# Altium schematic sheet modFOC-MCU.SchDoc: modFOC-MCU
size A4; Author: Thomas Hofmann; DocumentNumber: 2; Revision: 1.0; SheetNumber: 2; SheetTotal: 3
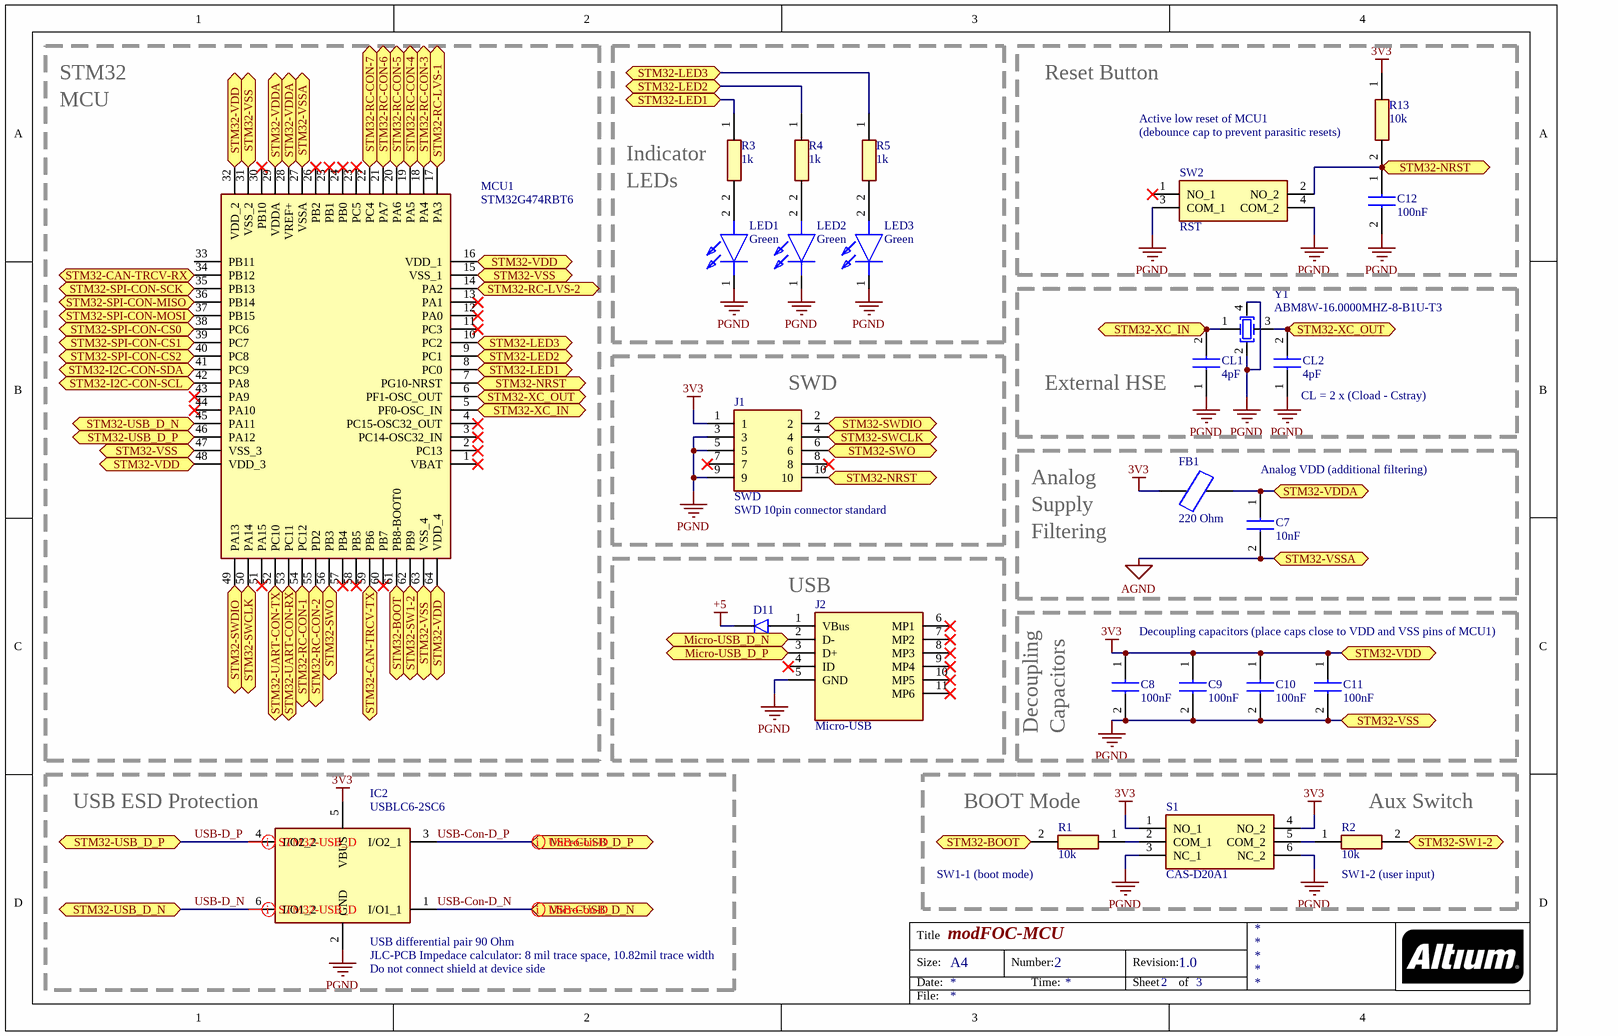
[diagram p0: modFOC-MCU.SchDoc]

## Parts
C7  10nF  [CAPC2012X88N]
C8  100nF  [CAPC1608X97N]
C9  100nF  [CAPC1608X97N]
C10  100nF  [CAPC1608X97N]
C11  100nF  [CAPC1608X97N]
C12  100nF  [CAPC1608X97N]
CL1  4pF  [CAPC1608X90N]
CL2  4pF  [CAPC1608X90N]
D11  BAS3010A03WE6327HTSA1  [SOD2513X110N]  (value not drawn)
FB1  220 Ohm  [BEADC1608X75N]
IC2  USBLC6-2SC6  [SOT95P280X145-6N]
J1  SWD  [HUSSP10W40P127_2X5_635X340X420P]
J2  Micro-USB  [19815841]
LED1  Green  [LGQ396PS35]
LED2  Green  [LGQ396PS35]
LED3  Green  [LGQ396PS35]
MCU1  STM32G474RBT6  [QFP50P1200X1200X160-64N]
R1  10k  [RESC1608X55N]
R2  10k  [RESC1608X55N]
R3  1k  [RESC1608X55N]
R4  1k  [RESC1608X55N]
R5  1k  [RESC1608X55N]
R13  10k  [RESC1608X55N]
S1  CAS-D20A1  [CASD20A1]
SW2  RST  [PTS647SK38SMTR2LFS]
Y1  ABM8W-16.0000MHZ-8-B1U-T3  [ABM8W160000MHZ8B1UT3]

## Blocks framed on the sheet
Reset Button: C12 R13 SW2
External HSE: CL1 CL2 Y1
SWD: J1
USB: D11 J2
USB ESD Protection: IC2

## Ports
Micro-USB_D_N (bidir), Micro-USB_D_P (bidir), STM32-BOOT (bidir), STM32-CAN-TRCV-RX (bidir), STM32-CAN-TRCV-TX (bidir), STM32-I2C-CON-SCL (bidir), STM32-I2C-CON-SDA (bidir), STM32-LED1 (bidir), STM32-LED2 (bidir), STM32-LED3 (bidir), STM32-NRST (bidir), STM32-RC-CON-1 (bidir), STM32-RC-CON-2 (bidir), STM32-RC-CON-3 (bidir), STM32-RC-CON-4 (bidir), STM32-RC-CON-5 (bidir), STM32-RC-CON-6 (bidir), STM32-RC-CON-7 (bidir), STM32-RC-LVS-1 (bidir), STM32-RC-LVS-2 (bidir), STM32-SPI-CON-CS0 (bidir), STM32-SPI-CON-CS1 (bidir), STM32-SPI-CON-CS2 (bidir), STM32-SPI-CON-MISO (bidir), STM32-SPI-CON-MOSI (bidir), STM32-SPI-CON-SCK (bidir), STM32-SW1-2 (bidir), STM32-SWCLK (bidir), STM32-SWDIO (bidir), STM32-SWO (bidir), STM32-UART-CON-RX (bidir), STM32-UART-CON-TX (bidir), STM32-USB_D_N (bidir), STM32-USB_D_P (bidir), STM32-VDD (bidir), STM32-VDDA (bidir), STM32-VSS (bidir), STM32-VSSA (bidir), STM32-XC_IN (bidir), STM32-XC_OUT (bidir)

## Nets
3V3: C8.1 C9.1 C10.1 C11.1 FB1.1 IC2.5(VBUS) J1.1 MCU1.16(VDD_1) MCU1.32(VDD_2) MCU1.48(VDD_3) MCU1.64(VDD_4) R13.1 S1.1(NO_1) S1.4(NO_2) ; port STM32-VDD
+5: D11.1(K)
AGND: C7.2 MCU1.27(VSSA) ; port STM32-VSSA
PGND: C8.2 C9.2 C10.2 C11.2 C12.2 CL1.1 CL2.1 IC2.2(GND) J1.3 J1.5 J1.9 J2.5(GND) LED1.1(K) LED2.1(K) LED3.1(K) MCU1.15(VSS_1) MCU1.31(VSS_2) MCU1.47(VSS_3) MCU1.63(VSS_4) S1.3(NC_1) S1.6(NC_2) SW2.3(COM_1) SW2.4(COM_2) Y1.2(OSC2) Y1.4 ; port STM32-VSS
STM32-BOOT: MCU1.61(PB8-BOOT0) R1.2 ; port STM32-BOOT
STM32-CAN-TRCV-RX: MCU1.34(PB12) ; port STM32-CAN-TRCV-RX
STM32-CAN-TRCV-TX: MCU1.59(PB6) ; port STM32-CAN-TRCV-TX
STM32-I2C-CON-SCL: MCU1.42(PA8) ; port STM32-I2C-CON-SCL
STM32-I2C-CON-SDA: MCU1.41(PC9) ; port STM32-I2C-CON-SDA
STM32-LED1: MCU1.8(PC0) R3.1 ; port STM32-LED1
STM32-LED2: MCU1.9(PC1) R4.1 ; port STM32-LED2
STM32-LED3: MCU1.10(PC2) R5.1 ; port STM32-LED3
STM32-NRST: C12.1 J1.10 MCU1.7(PG10-NRST) R13.2 SW2.2(NO_2) ; port STM32-NRST
STM32-RC-CON-1: MCU1.54(PC12) ; port STM32-RC-CON-1
STM32-RC-CON-2: MCU1.55(PD2) ; port STM32-RC-CON-2
STM32-RC-CON-3: MCU1.18(PA4) ; port STM32-RC-CON-3
STM32-RC-CON-4: MCU1.19(PA5) ; port STM32-RC-CON-4
STM32-RC-CON-5: MCU1.20(PA6) ; port STM32-RC-CON-5
STM32-RC-CON-6: MCU1.21(PA7) ; port STM32-RC-CON-6
STM32-RC-CON-7: MCU1.22(PC4) ; port STM32-RC-CON-7
STM32-RC-LVS-1: MCU1.17(PA3) ; port STM32-RC-LVS-1
STM32-RC-LVS-2: MCU1.14(PA2) ; port STM32-RC-LVS-2
STM32-SPI-CON-CS0: MCU1.38(PC6) ; port STM32-SPI-CON-CS0
STM32-SPI-CON-CS1: MCU1.39(PC7) ; port STM32-SPI-CON-CS1
STM32-SPI-CON-CS2: MCU1.40(PC8) ; port STM32-SPI-CON-CS2
STM32-SPI-CON-MISO: MCU1.36(PB14) ; port STM32-SPI-CON-MISO
STM32-SPI-CON-MOSI: MCU1.37(PB15) ; port STM32-SPI-CON-MOSI
STM32-SPI-CON-SCK: MCU1.35(PB13) ; port STM32-SPI-CON-SCK
STM32-SW1-2: MCU1.62(PB9) R2.2 ; port STM32-SW1-2
STM32-SWCLK: J1.4 MCU1.50(PA14) ; port STM32-SWCLK
STM32-SWDIO: J1.2 MCU1.49(PA13) ; port STM32-SWDIO
STM32-SWO: J1.6 MCU1.56(PB3) ; port STM32-SWO
STM32-UART-CON-RX: MCU1.53(PC11) ; port STM32-UART-CON-RX
STM32-UART-CON-TX: MCU1.52(PC10) ; port STM32-UART-CON-TX
STM32-VDDA: C7.1 FB1.2 MCU1.28(VREF+) MCU1.29(VDDA) ; port STM32-VDDA
STM32-XC_IN: CL1.2 MCU1.5(PF0-OSC_IN) Y1.1(OSC1) ; port STM32-XC_IN
STM32-XC_OUT: CL2.2 MCU1.6(PF1-OSC_OUT) Y1.3 ; port STM32-XC_OUT
USB-Con-D_N: IC2.1(I/O1_1) J2.2(D-) ; port Micro-USB_D_N
USB-Con-D_P: IC2.3(I/O2_1) J2.3(D+) ; port Micro-USB_D_P
USB-D_N: IC2.6(I/O1_2) MCU1.45(PA11) ; port STM32-USB_D_N
USB-D_P: IC2.4(I/O2_2) MCU1.46(PA12) ; port STM32-USB_D_P
NetD11_2: D11.2(A) J2.1(VBus)
NetLED1_2: LED1.2(A) R3.2
NetLED2_2: LED2.2(A) R4.2
NetLED3_2: LED3.2(A) R5.2
NetR1_1: R1.1 S1.2(COM_1)
NetR2_1: R2.1 S1.5(COM_2)

Not connected (* = marked no-connect by the designer): J1 7* 8*; J2 4(ID)* 6(MP1)* 7(MP2)* 8(MP3)* 9(MP4)* 10(MP5)* 11(MP6)*; MCU1 1(VBAT)* 2(PC13)* 3(PC14-OSC32_IN)* 4(PC15-OSC32_OUT)* 11(PC3)* 12(PA0)* 13(PA1)* 23(PC5)* 24(PB0)* 25(PB1)* 26(PB2)* 30(PB10)* 33(PB11) 43(PA9)* 44(PA10)* 51(PA15)* 57(PB4)* 58(PB5)* 60(PB7)*; SW2 1(NO_1)*

## Layout directives
differential pair; rule Differential Pairs Routing [Pref Gap = 10mil    Min Gap  = 8mil    Max Gap  = 10milPref Width = 15mil    Min Width  = 10.28mil    Max Width  = 15mil]: USB-Con-D_N, USB-Con-D_P, USB-D_N, USB-D_P

## Notes on the sheet
- STM32
- MCU
- (near R3) Indicator
- Active low reset of MCU1
- (near R13) (debounce cap to prevent parasitic resets)
- LEDs
- (near CL2) CL = 2 x (Cload - Cstray)
- (near J1) SWD 10pin connector standard
- Analog
- Supply
- Analog VDD (additional filtering)
- Filtering
- Decoupling capacitors (place caps close to VDD and VSS pins of MCU1)
- Decoupling
- Capacitors
- (near R1) BOOT Mode
- (near R2) Aux Switch
- (near R1) SW1-1 (boot mode)
- (near R2) SW1-2 (user input)
- (near IC2) USB differential pair 90 Ohm
- (near IC2) JLC-PCB Impedace calculator: 8 mil trace space, 10.82mil trace width
- (near IC2) Do not connect shield at device side
- Title
- Size:
- Date:
- A4
- Number:
- Time:
- Revision:
- Sheet
- of
- File:

## Library data of the parts
C7 = C0805C103J3GACTU: Capacitor; Manufacturer_Name: Kemet; Datasheet Link: https://componentsearchengine.com/Datasheets/2/C0805C103J3GACTU.pdf; Height: 0.88mm; Manufacturer_Part_Number: C0805C103J3GACTU; Arrow Part Number: C0805C103J3GACTU; Arrow Price/Stock: https://www.arrow.com/en/products/c0805c103j3gactu/kemet-corporation; Mouser Part Number: 80-C0805C103J3G; Mouser Price/Stock: https://www.mouser.co.uk/ProductDetail/KEMET/C0805C103J3GACTU?qs=K%2Fj%2Fqf%252B0fqJFcB%2FiaHub0Q%3D%3D
C8-C12 = VJ0603Y104JXJAC: Capacitor; Manufacturer_Name: Vishay; Datasheet Link: http://www.vishay.com/docs/45226/vj31xrohsautomlcc.pdf; Height: 0.97mm; Manufacturer_Part_Number: VJ0603Y104JXJAC; Mouser Part Number: 77-VJ0603Y104JXJAC; Mouser Price/Stock: https://www.mouser.com/Search/Refine.aspx?Keyword=77-VJ0603Y104JXJAC
CL1 CL2 = CL10C040CB8NNNC: Capacitor; Manufacturer_Name: Samsung Electro-Mechanics; Datasheet Link: https://datasheet.lcsc.com/szlcsc/Samsung-Electro-Mechanics-CL10C040CB8NNNC_C307494.pdf; Height: 0.9mm; Manufacturer_Part_Number: CL10C040CB8NNNC; Mouser Part Number: N/A; Mouser Price/Stock: https://www.mouser.co.uk/ProductDetail/Samsung-Electro-Mechanics/CL10C040CB8NNNC?qs=X6jEic%2FHinCXvSxHicvHqA%3D%3D; Arrow Part Number: CL10C040CB8NNNC; Arrow Price/Stock: https://www.arrow.com/en/products/cl10c040cb8nnnc/samsung-electro-mechanics
D11 = BAS3010A03WE6327HTSA1: Diode; Manufacturer_Name: Infineon; Datasheet Link: https://www.infineon.com/dgdl/Infineon-BAS3010ASERIES-DS-v01_01-en.pdf?fileId=db3a30431ddc9372011dfbc50f231c06; Height: 1.1mm; Manufacturer_Part_Number: BAS3010A03WE6327HTSA1; Arrow Part Number: BAS3010A03WE6327HTSA1; Arrow Price/Stock: https://www.arrow.com/en/products/bas3010a03we6327htsa1/infineon-technologies-ag; Mouser Part Number: 726-BAS3010A-03WE6; Mouser Price/Stock: https://www.mouser.co.uk/ProductDetail/Infineon-Technologies/BAS3010A03WE6327HTSA1?qs=K00xGehIljtEbk1%252B2pLZ%252BQ%3D%3D
FB1 = MPZ1608S221ATA00: Ferrite Bead; Manufacturer_Name: TDK; Datasheet Link: https://product.tdk.com/info/en/catalog/datasheets/beads_commercial_power_mpz1608_en.pdf; Height: 0.75mm; Manufacturer_Part_Number: MPZ1608S221ATA00; Mouser Part Number: 810-MPZ1608S221ATA00; Mouser Price/Stock: https://www.mouser.co.uk/ProductDetail/TDK/MPZ1608S221ATA00/?qs=pLY5GE0xrmLZeKkazChaNg%3D%3D; Arrow Part Number: MPZ1608S221ATA00; Arrow Price/Stock: https://www.arrow.com/en/products/mpz1608s221ata00/tdk
IC2 = USBLC6-2SC6: Integrated Circuit; Manufacturer_Name: STMicroelectronics; Datasheet Link: http://www.st.com/st-web-ui/static/active/en/resource/technical/document/datasheet/CD00050750.pdf; Height: 1.45mm; Manufacturer_Part_Number: USBLC6-2SC6; Arrow Part Number: USBLC6-2SC6; Arrow Price/Stock: https://www.arrow.com/en/products/usblc6-2sc6/stmicroelectronics; Mouser Part Number: 511-USBLC6-2SC6; Mouser Price/Stock: https://www.mouser.co.uk/ProductDetail/STMicroelectronics/USBLC6-2SC6?qs=po45yt2pPpu%2FhNIlwQdTlg%3D%3D
J1 = M50-3600542R: Connector; Manufacturer_Name: Harwin; Datasheet Link: https://cdn.harwin.com/pdfs/M50-360R.pdf; Manufacturer_Part_Number: M50-3600542R; Mouser Part Number: 855-M50-3600542R; Mouser Price/Stock: https://www.mouser.co.uk/ProductDetail/Harwin/M50-3600542R?qs=DVxm2sPGGrrPu%2FxuhpV3yw%3D%3D
J2 = 1981584-1: Connector; Manufacturer_Name: TE Connectivity; Datasheet Link: http://www.te.com/commerce/DocumentDelivery/DDEController?Action=showdoc&DocId=Customer+Drawing%7F1981584%7FD2%7Fpdf%7FEnglish%7FENG_CD_1981584_D2.pdf%7F1981584-1; Height: 3mm; Manufacturer_Part_Number: 1981584-1; Arrow Part Number: 1981584-1; Arrow Price/Stock: https://www.arrow.com/en/products/1981584-1/te-connectivity; Mouser Part Number: 571-1981584-1; Mouser Price/Stock: https://www.mouser.co.uk/ProductDetail/TE-Connectivity/1981584-1?qs=ozkTL%2FUej0TLYxjQLPnd2Q%3D%3D
LED1-LED3 = LG_Q396-PS-35: LED; Manufacturer_Name: OSRAM; Manufacturer_Part_Number: LG Q396-PS-35; Datasheet Link: https://mouser.componentsearchengine.com/Datasheets/2/LG%20Q396-PS-35.pdf; Height: 0.4mm; Arrow Part Number: LG Q396-PS-35; Arrow Price/Stock: https://www.arrow.com/en/products/lgq396-ps-35/osram-opto-semiconductors; Mouser Part Number: 720-LGQ396A3964; Mouser Price/Stock: https://www.mouser.co.uk/ProductDetail/OSRAM-Opto-Semiconductors/LG-Q396-PS-35?qs=xC%252BE9h5iuX5%252BCocujXxOpw%3D%3D
MCU1 = STM32G474RBT6: Integrated Circuit; Manufacturer_Name: STMicroelectronics; Datasheet Link: https://www.mouser.com/datasheet/2/389/stm32g474cb-1600828.pdf; Height: 1.6mm; Manufacturer_Part_Number: STM32G474RBT6; Mouser Part Number: 511-STM32G474RBT6; Mouser Price/Stock: https://www.mouser.co.uk/ProductDetail/STMicroelectronics/STM32G474RBT6?qs=uwxL4vQweFP0uAZUZXLBhQ%3D%3D
R1 R2 R13 = MCT06030C1002FP500: Resistor; Manufacturer_Name: Vishay; Datasheet Link: http://www.vishay.com/docs/28705/mcx0x0xpro.pdf; Height: 0.55mm; Manufacturer_Part_Number: MCT06030C1002FP500; Mouser Part Number: 594-MCT06030C1002FP5; Mouser Price/Stock: https://www.mouser.co.uk/ProductDetail/Vishay-Beyschlag/MCT06030C1002FP500?qs=Wvg1umJc15zoHgIjwqoGHw%3D%3D
R3-R5 = MCT06030C1001FP500: Resistor; Manufacturer_Name: Vishay; Datasheet Link: http://www.vishay.com/docs/28705/mcx0x0xpro.pdf; Height: 0.55mm; Manufacturer_Part_Number: MCT06030C1001FP500; Mouser Part Number: 594-MCT06030C1001FP5; Mouser Price/Stock: https://www.mouser.co.uk/ProductDetail/Vishay-Beyschlag/MCT06030C1001FP500?qs=7ZE6F4QMOBbsjeUdqW8cwA%3D%3D
S1 = CAS-D20A1: Switch; Manufacturer_Name: Copal Electronics; Datasheet Link: https://www.nidec-copal-electronics.com/e/catalog/switch/cas.pdf; Height: 2.5mm; Manufacturer_Part_Number: CAS-D20A1
SW2 = PTS_647_SK38_SMTR2_LFS: Switch; Manufacturer_Name: C & K COMPONENTS; Manufacturer_Part_Number: PTS 647 SK38 SMTR2 LFS; Datasheet Link: https://dznh3ojzb2azq.cloudfront.net/products/Tactile/PTS647/documents/datasheet.pdf; Height: 3.8mm; Arrow Part Number: PTS 647 SK38 SMTR2 LFS; Arrow Price/Stock: https://www.arrow.com/en/products/pts-647-sk38-smtr2-lfs/ck
Y1 = ABM8W-16.0000MHZ-8-B1U-T3: Crystal or Oscillator; Manufacturer_Name: ABRACON; Datasheet Link: https://abracon.com/Resonators/ABM8W.pdf; Height: 0.75mm; Manufacturer_Part_Number: ABM8W-16.0000MHZ-8-B1U-T3; Mouser Part Number: 815-8W16-8B1UT; Mouser Price/Stock: https://www.mouser.co.uk/ProductDetail/ABRACON/ABM8W-160000MHZ-8-B1U-T3?qs=5aG0NVq1C4zuwTHNFUIcqw%3D%3D; Arrow Part Number: ABM8W-16.0000MHZ-8-B1U-T3; Arrow Price/Stock: https://www.arrow.com/en/products/abm8w-16.0000mhz-8-b1u-t3/abracon